# EasyEDA Pro project F401.eprj

# Schematic Schematic1
Board Name: Board1; Create Date: 2025-04-14; Page Name: P1; Project Name: F401; Schematic Name: Schematic1; Update Date: 2025-04-16; Company: 嘉立创EDA; Page Size: A4; Version: V1.0
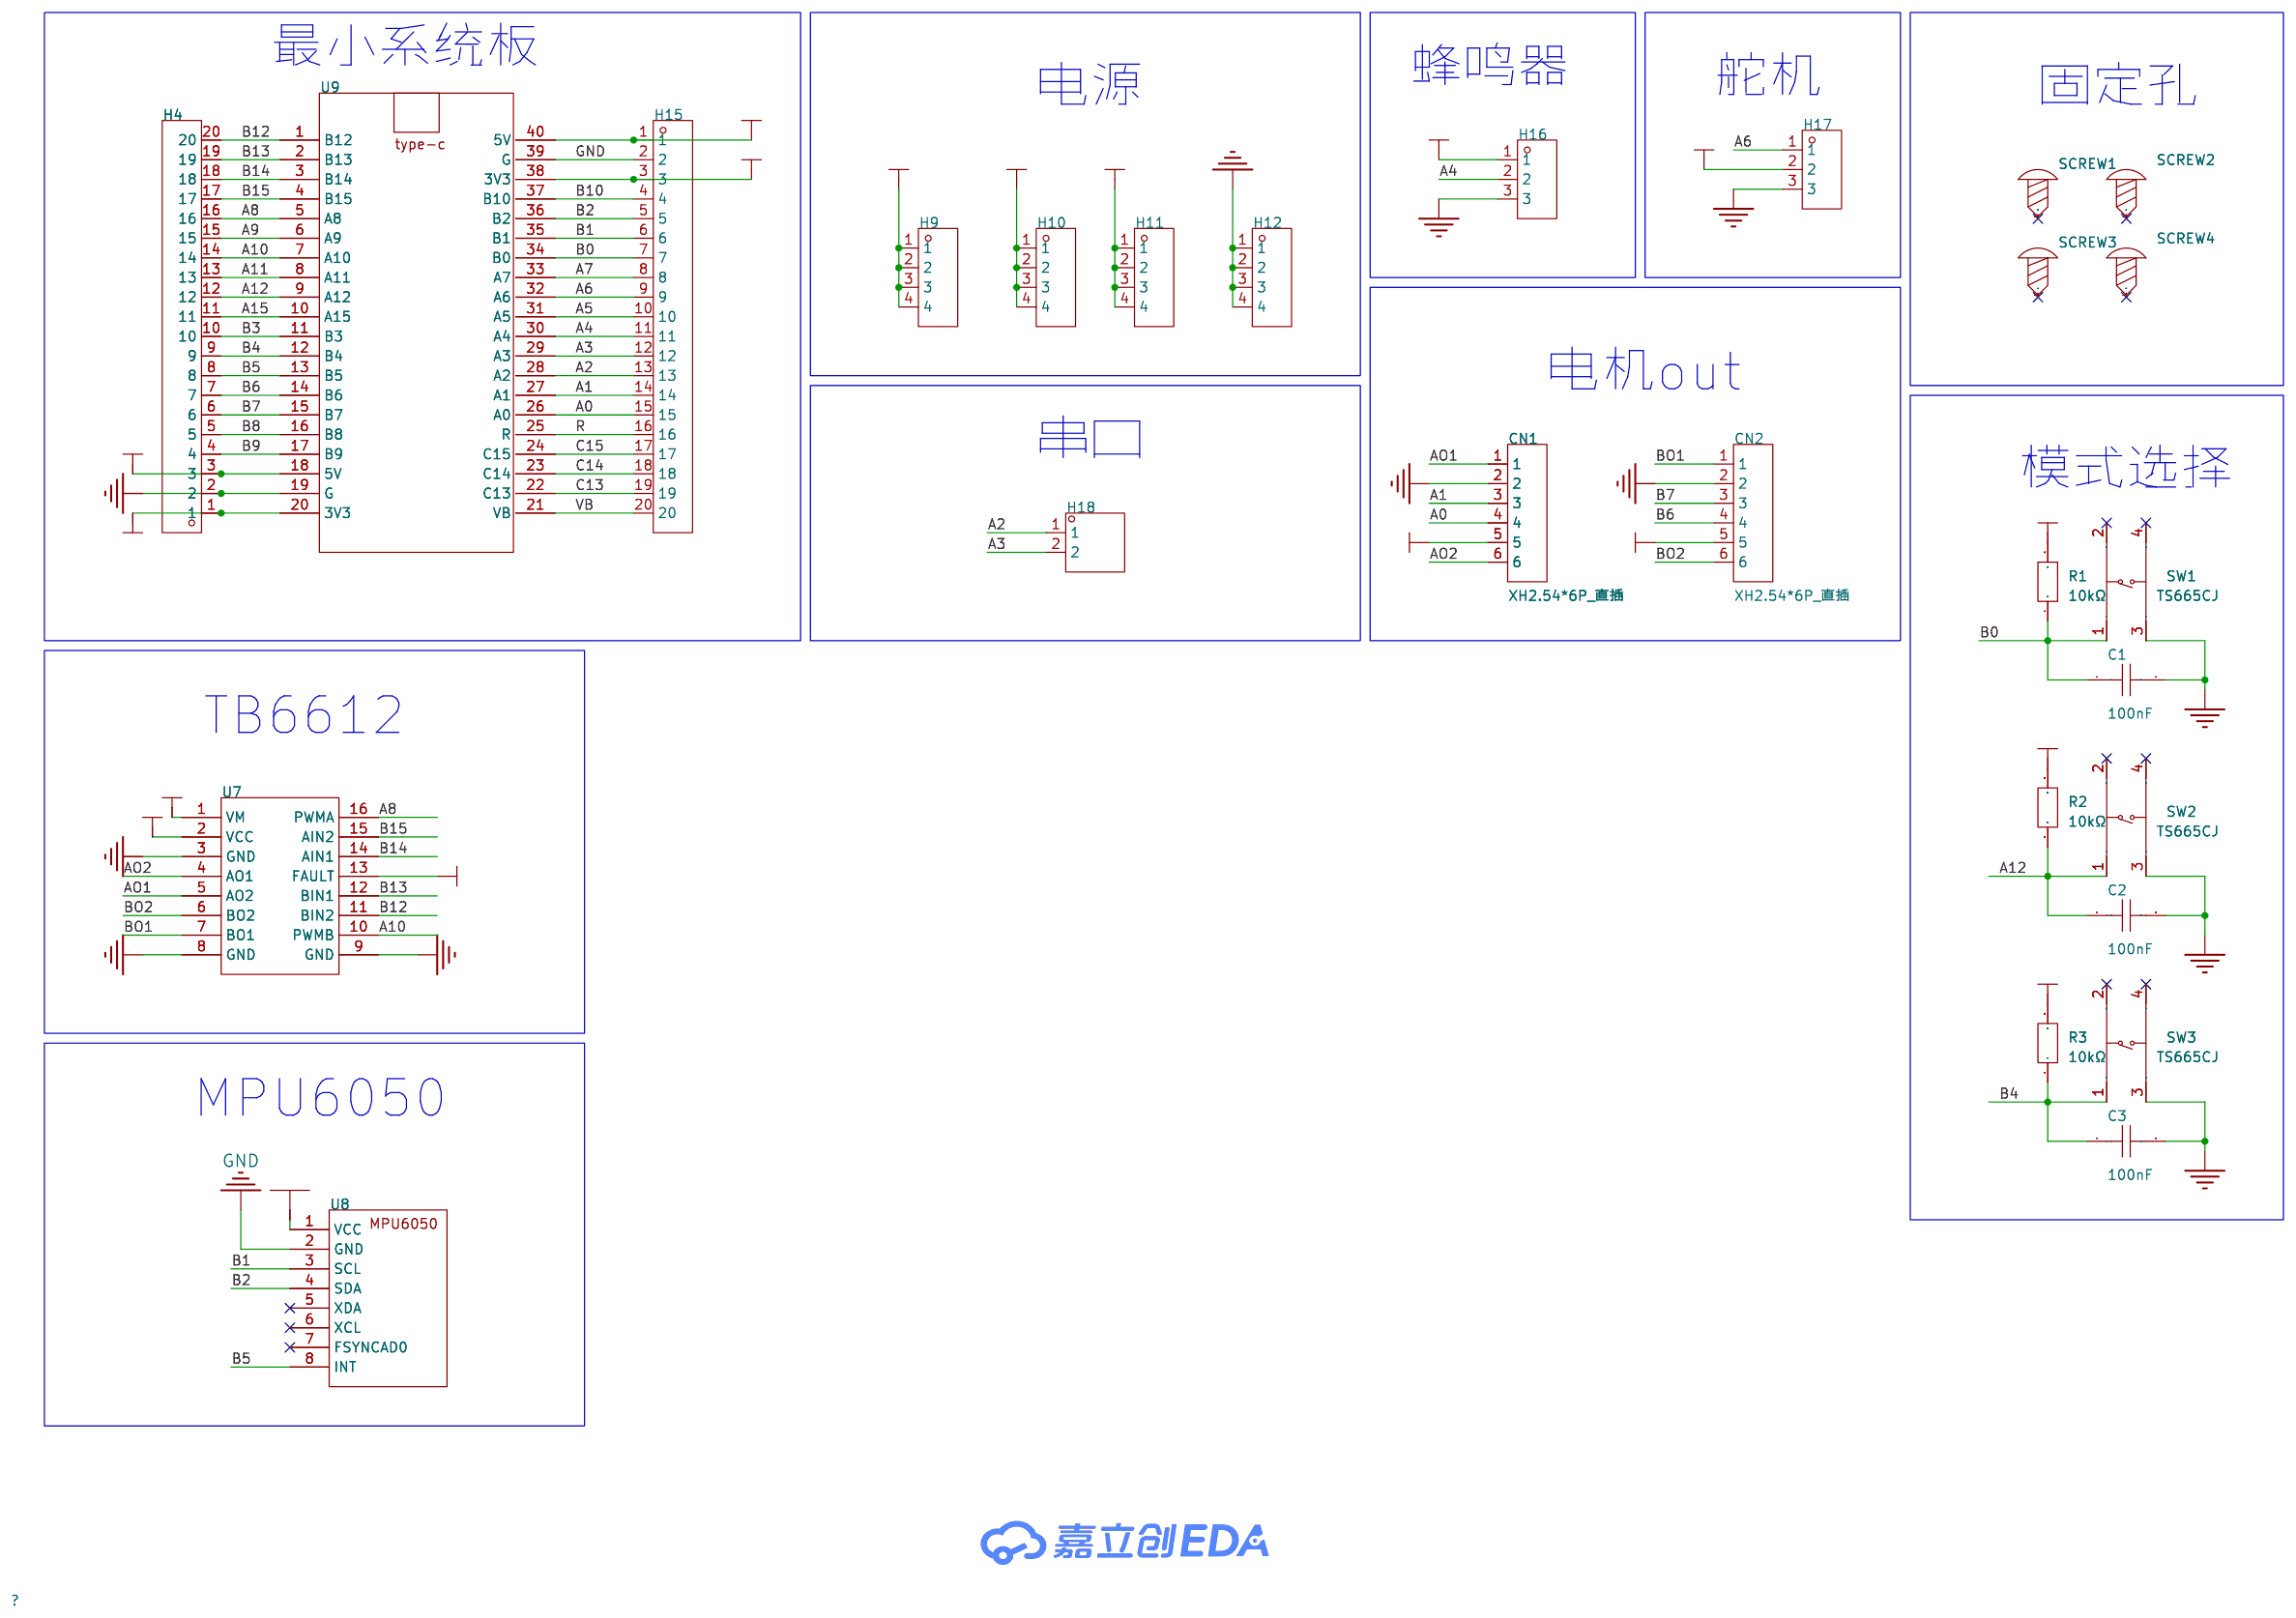
[diagram p0: schematic sheet]

## Parts
C1  100nF  [CAP-TH_L5.0-W2.5-P5.00-D1.0]
C2  100nF  [CAP-TH_L5.0-W2.5-P5.00-D1.0]
C3  100nF  [CAP-TH_L5.0-W2.5-P5.00-D1.0]
CN1  XH2.54*6P_直插  [CONN-TH_XH2.54-6P]
CN2  XH2.54*6P_直插  [CONN-TH_XH2.54-6P]
H4  -  [HDR-TH_20P-P2.54-V-M-1]
H9  -  [HDR-TH_4P-P2.54-V-M]
H10  -  [HDR-TH_4P-P2.54-V-M]
H11  -  [HDR-TH_4P-P2.54-V-M]
H12  -  [HDR-TH_4P-P2.54-V-M]
H15  -  [HDR-TH_20P-P2.54-V-M-1]
H16  -  [HDR-TH_3P-P2.54-V-F]
H17  -  [HDR-TH_3P-P2.54-V-M]
H18  -  [HDR-TH_2P-P2.54-V-M-1]
R1  10kΩ  [RES-TH_BD2.7-L6.2-P10.20-D0.4]
R2  10kΩ  [RES-TH_BD2.7-L6.2-P10.20-D0.4]
R3  10kΩ  [RES-TH_BD2.7-L6.2-P10.20-D0.4]
SCREW1  -  [M3螺丝]
SCREW2  -  [M3螺丝]
SCREW3  -  [M3螺丝]
SCREW4  -  [M3螺丝]
SW1  TS665CJ  [SW-TH_4P-L6.0-W6.0-P4.50-LS6.5]
SW2  TS665CJ  [SW-TH_4P-L6.0-W6.0-P4.50-LS6.5]
SW3  TS665CJ  [SW-TH_4P-L6.0-W6.0-P4.50-LS6.5]
U7  -  [TB6612FNG]
U8  -  [MPU6050]
U9  -  [F401CCU6]

## Library data of the parts
C1-C3 = CC1H104MC1FD3F6C10MF: LCSC Part Name: 100nF ±20% 50V; Supplier Part: C254085; Manufacturer: Dersonic(德尔创); Supplier Footprint: 插件,P=5.08mm; JLCPCB Part Class: 扩展库; Datasheet: https://atta.szlcsc.com/upload/public/pdf/source/20200826/C254085_159DD65BF32BF11C9168D341BCE23E6F.pdf; Supplier: LCSC; Tolerance: ±20%; Voltage Rating: 50V; Pin Spacing: 5.08mm; Temperature Coefficient: Y5V; Diameter: 6mm; Body Thickness: 2.2mm
CN1 CN2 = XH2.54*6P_直插: Supplier Part: C9900008614; Supplier Footprint: XH2.54_6P; JLCPCB Part Class: 扩展库; Supplier: LCSC
H4 H15 = HDR-M_2.54_1x20P: 间距:2.54mm;总PIN位数:20;排数:1;插针结构:-;行距:-;安装类型:直插;圆针/方针:-;额定电流:-;额定电压:-;配合针长度:-;塑高:-;触头材质:黄铜;触头镀层:-;颜色:黑色;; Supplier Part: C50981; Supplier Footprint: 插件
H9-H12 = HDR-M_2.54_1x4P: Supplier Part: C492403; Supplier Footprint: 插件
H16 = HDR-F_2.54_1x3P: Supplier Part: C541850; Supplier Footprint: 插件
H17 = HDR-M_2.54_1x3P: Supplier Part: C2937625; Supplier Footprint: 插件
H18 = HDR-M_2.54_1x2P: Supplier Part: C124375; Supplier Footprint: 插件
R1-R3 = MF1/4W-1K±1%-ST52: LCSC Part Name: 金属膜电阻 1kΩ ±1% 250mW; Supplier Part: C2903245; Manufacturer: VO(翔胜); Supplier Footprint: 插件,D2.7xL6.2mm; JLCPCB Part Class: 扩展库; Datasheet: https://atta.szlcsc.com/upload/public/pdf/source/20200609/C601728_5AA4C0C8E12E11069DA2C3356F29D1F2.pdf; Supplier: LCSC; Type: 金属膜电阻; Tolerance: ±1%; Overload Voltage (Max): 250V; Power(Watts): 250mW; Temperature Coefficient: ±100ppm/℃; Operating Temperature Range: -55℃~+155℃
SCREW1-SCREW4 = M3螺丝: Supplier Footprint: 插件
SW1-SW3 = TS665CJ: LCSC Part Name: 6*6*5mm 直插 轻触开关; Supplier Part: C393938; Manufacturer: SHOU HAN(首韩); Supplier Footprint: 插件; JLCPCB Part Class: 扩展库; Datasheet: https://atta.szlcsc.com/upload/public/pdf/source/20190521/C393938_BDABEAC600B4C55E200A80AA129B70BC.pdf; Supplier: LCSC; Circuit: 单刀单掷; Actuator Style: 圆形按钮; Mounting Style: 直插; Switch Length: 6mm; Switch Width: 6mm; Switch Height: 5mm; Contact Current: 50mA; Voltage Rating (DC): 12V
U7 = TB6612FNG
U8 = MPU6050
U9 = F401CCU6

## Nets
3V3: H4.1 H11.1 H11.2 H11.3 H11.4 H15.3 H16.1 R1.2 R2.2 R3.2 U9.20(3V3) U9.38(3V3)
5V: CN1.5 CN2.5 H4.3 H10.1 H10.2 H10.3 H10.4 H15.1 H17.2 U7.2(VCC) U7.13(FAULT) U8.1(VCC) U9.18(5V) U9.40(5V)
12V: H9.1 H9.2 H9.3 H9.4 U7.1(VM)
GND: C1.2 C2.2 C3.2 CN1.2 CN2.2 H4.2 H12.1 H12.2 H12.3 H12.4 H15.2 H16.3 H17.3 SW1.3(C) SW2.3(C) SW3.3(C) U7.3(GND) U7.8(GND) U7.9(GND) U8.2(GND) U9.19(G) U9.39(G)
A0: CN1.4 H15.15 U9.26(A0)
A1: CN1.3 H15.14 U9.27(A1)
A2: H15.13 H18.1 U9.28(A2)
A3: H15.12 H18.2 U9.29(A3)
A4: H15.11 H16.2 U9.30(A4)
A5: H15.10 U9.31(A5)
A6: H15.9 H17.1 U9.32(A6)
A7: H15.8 U9.33(A7)
A8: H4.16 U7.16(PWMA) U9.5(A8)
A9: H4.15 U9.6(A9)
A10: H4.14 U7.10(PWMB) U9.7(A10)
A11: H4.13 U9.8(A11)
A12: C2.1 H4.12 R2.1 SW2.1(A) U9.9(A12)
A15: H4.11 U9.10(A15)
AO1: CN1.1 U7.5(AO2)
AO2: CN1.6 U7.4(AO1)
B0: C1.1 H15.7 R1.1 SW1.1(A) U9.34(B0)
B1: H15.6 U8.3(SCL) U9.35(B1)
B2: H15.5 U8.4(SDA) U9.36(B2)
B3: H4.10 U9.11(B3)
B4: C3.1 H4.9 R3.1 SW3.1(A) U9.12(B4)
B5: H4.8 U8.8(INT) U9.13(B5)
B6: CN2.4 H4.7 U9.14(B6)
B7: CN2.3 H4.6 U9.15(B7)
B8: H4.5 U9.16(B8)
B9: H4.4 U9.17(B9)
B10: H15.4 U9.37(B10)
B12: H4.20 U7.11(BIN2) U9.1(B12)
B13: H4.19 U7.12(BIN1) U9.2(B13)
B14: H4.18 U7.14(AIN1) U9.3(B14)
B15: H4.17 U7.15(AIN2) U9.4(B15)
BO1: CN2.1 U7.7(BO1)
BO2: CN2.6 U7.6(BO2)
C13: H15.19 U9.22(C13)
C14: H15.18 U9.23(C14)
C15: H15.17 U9.24(C15)
R: H15.16 U9.25(R)
VB: H15.20 U9.21(VB)

Not connected (* = marked no-connect by the designer): SCREW1 1*; SCREW2 1*; SCREW3 1*; SCREW4 1*; SW1 2(B)* 4(D)*; SW2 2(B)* 4(D)*; SW3 2(B)* 4(D)*; U8 5(XDA)* 6(XCL)* 7(FSYNCAD0)*

## Notes on the sheet
- 最小系统板
- 蜂鸣器
- 电源
- 舵机
- 固定孔
- 电机out
- 串口
- 模式选择
- TB6612
- MPU6050

# Board PCB1
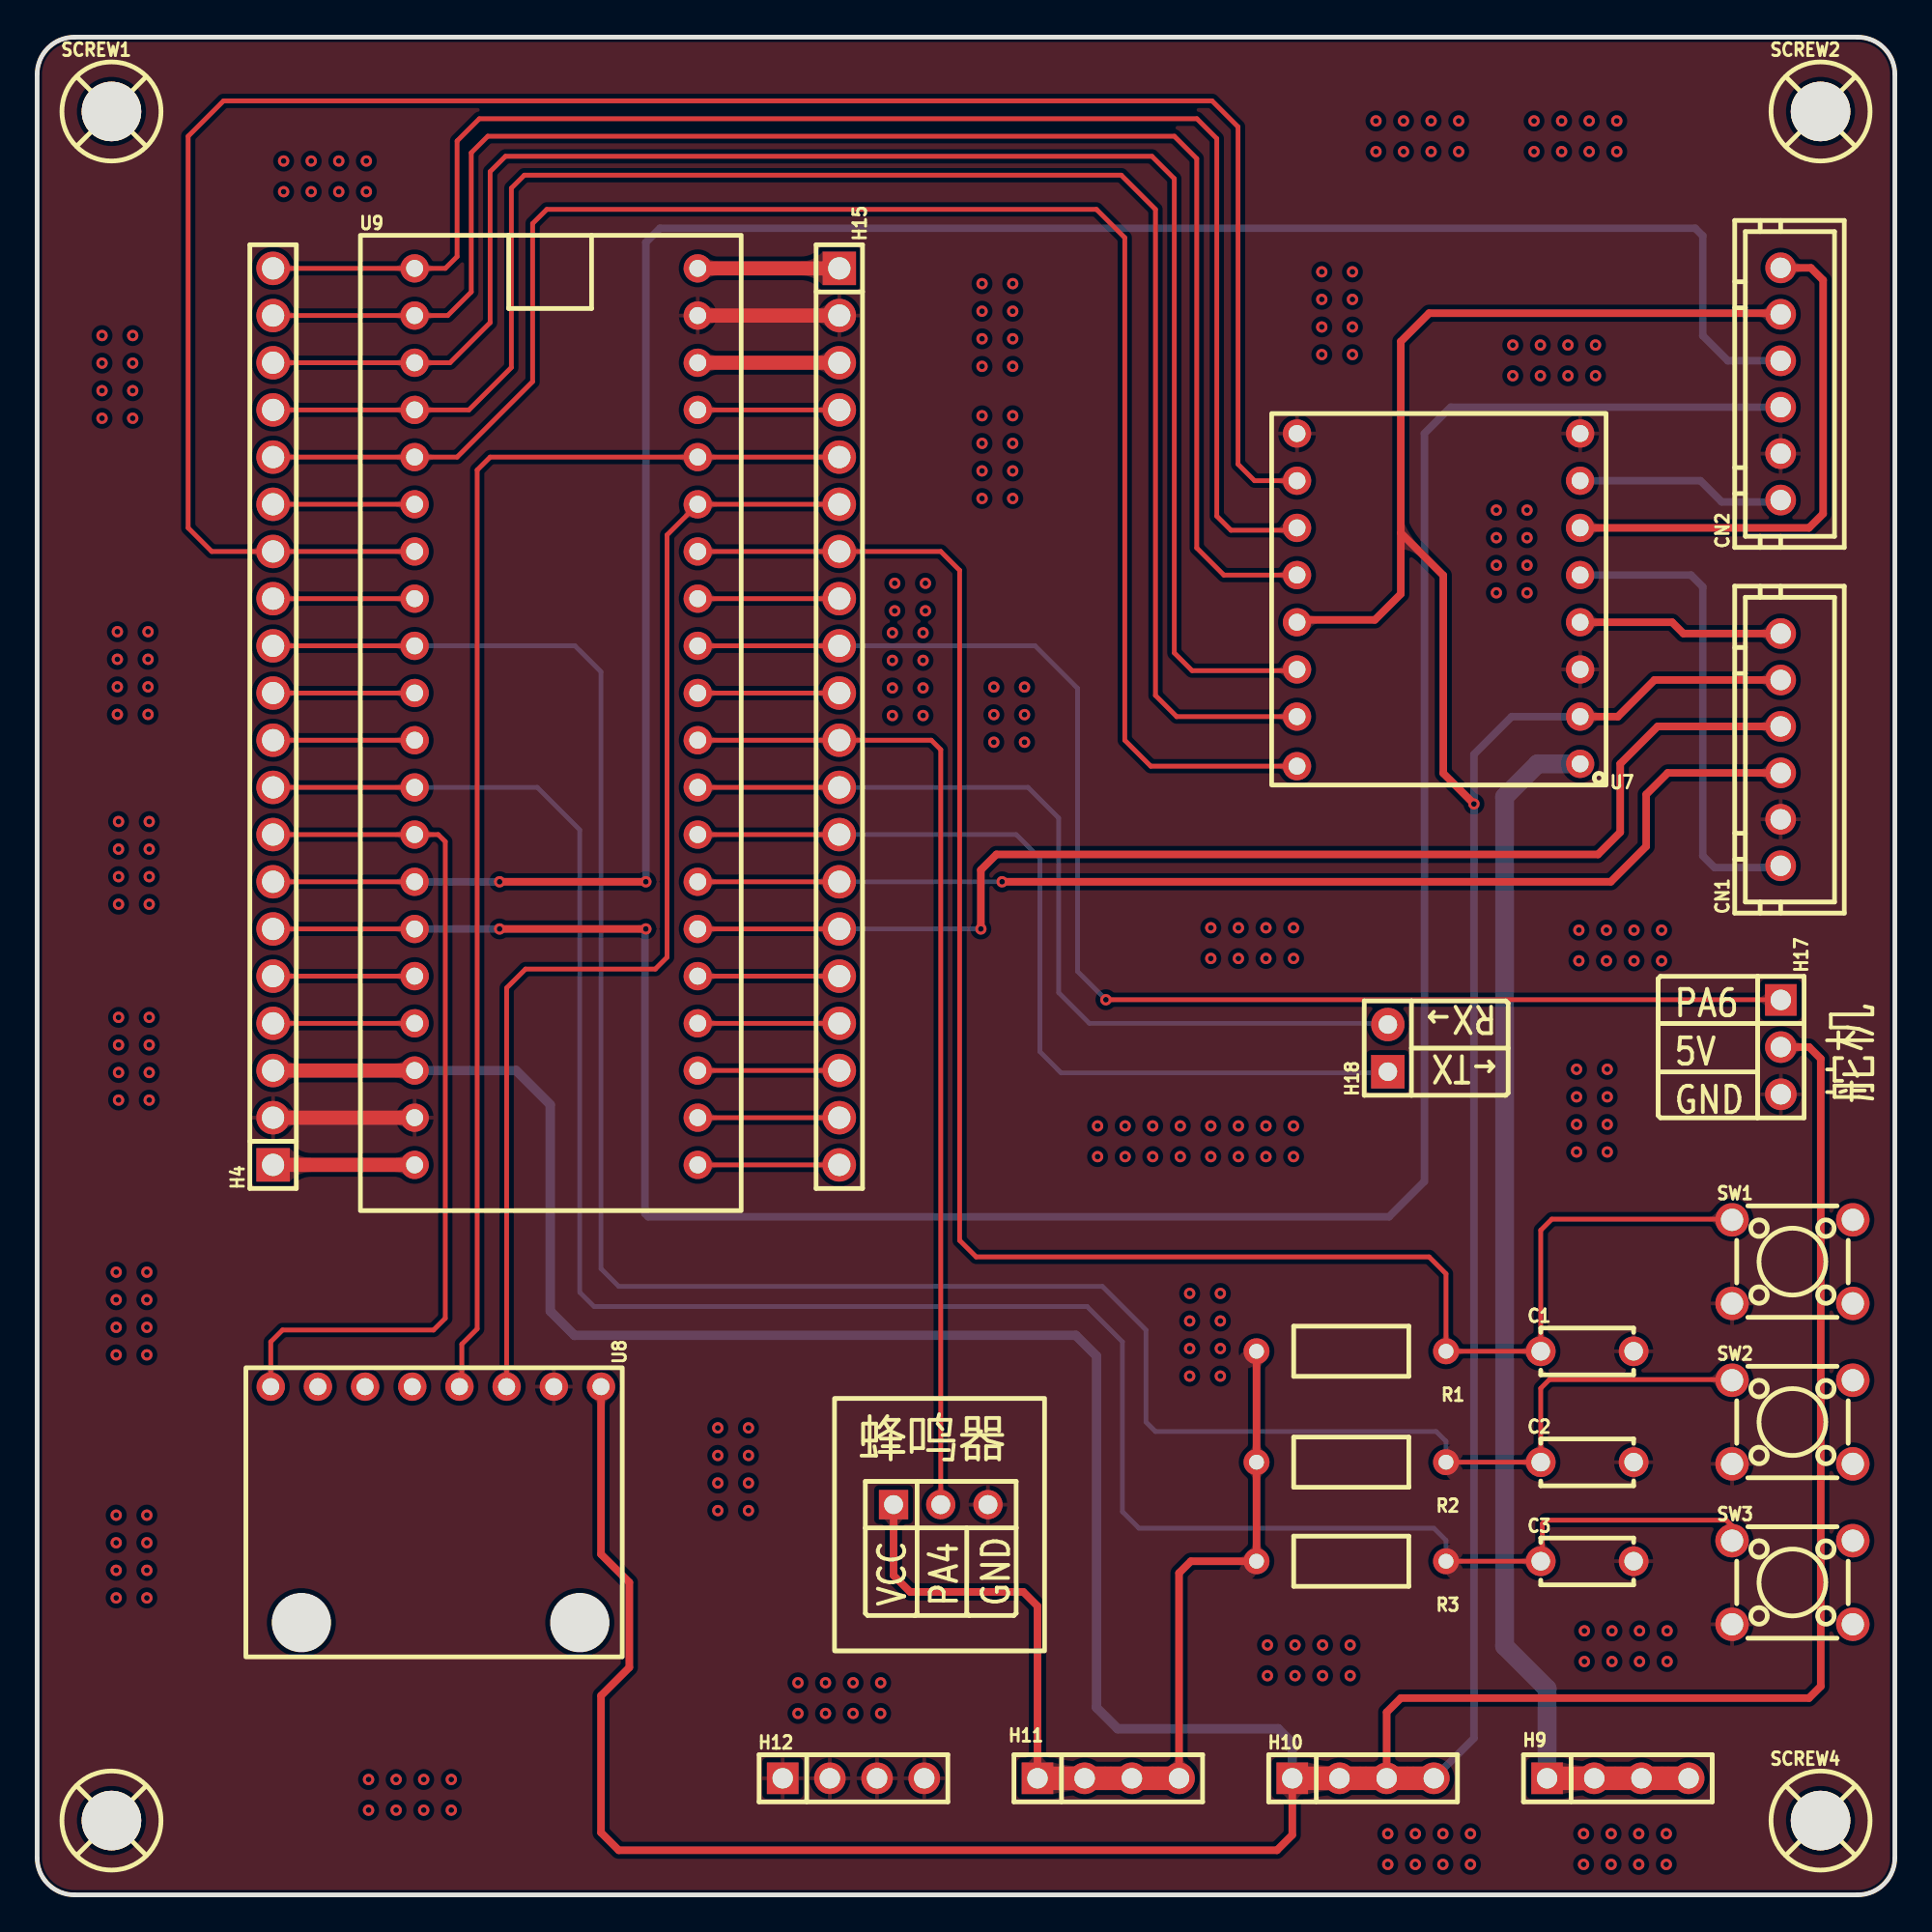
[diagram p1: board, top side]
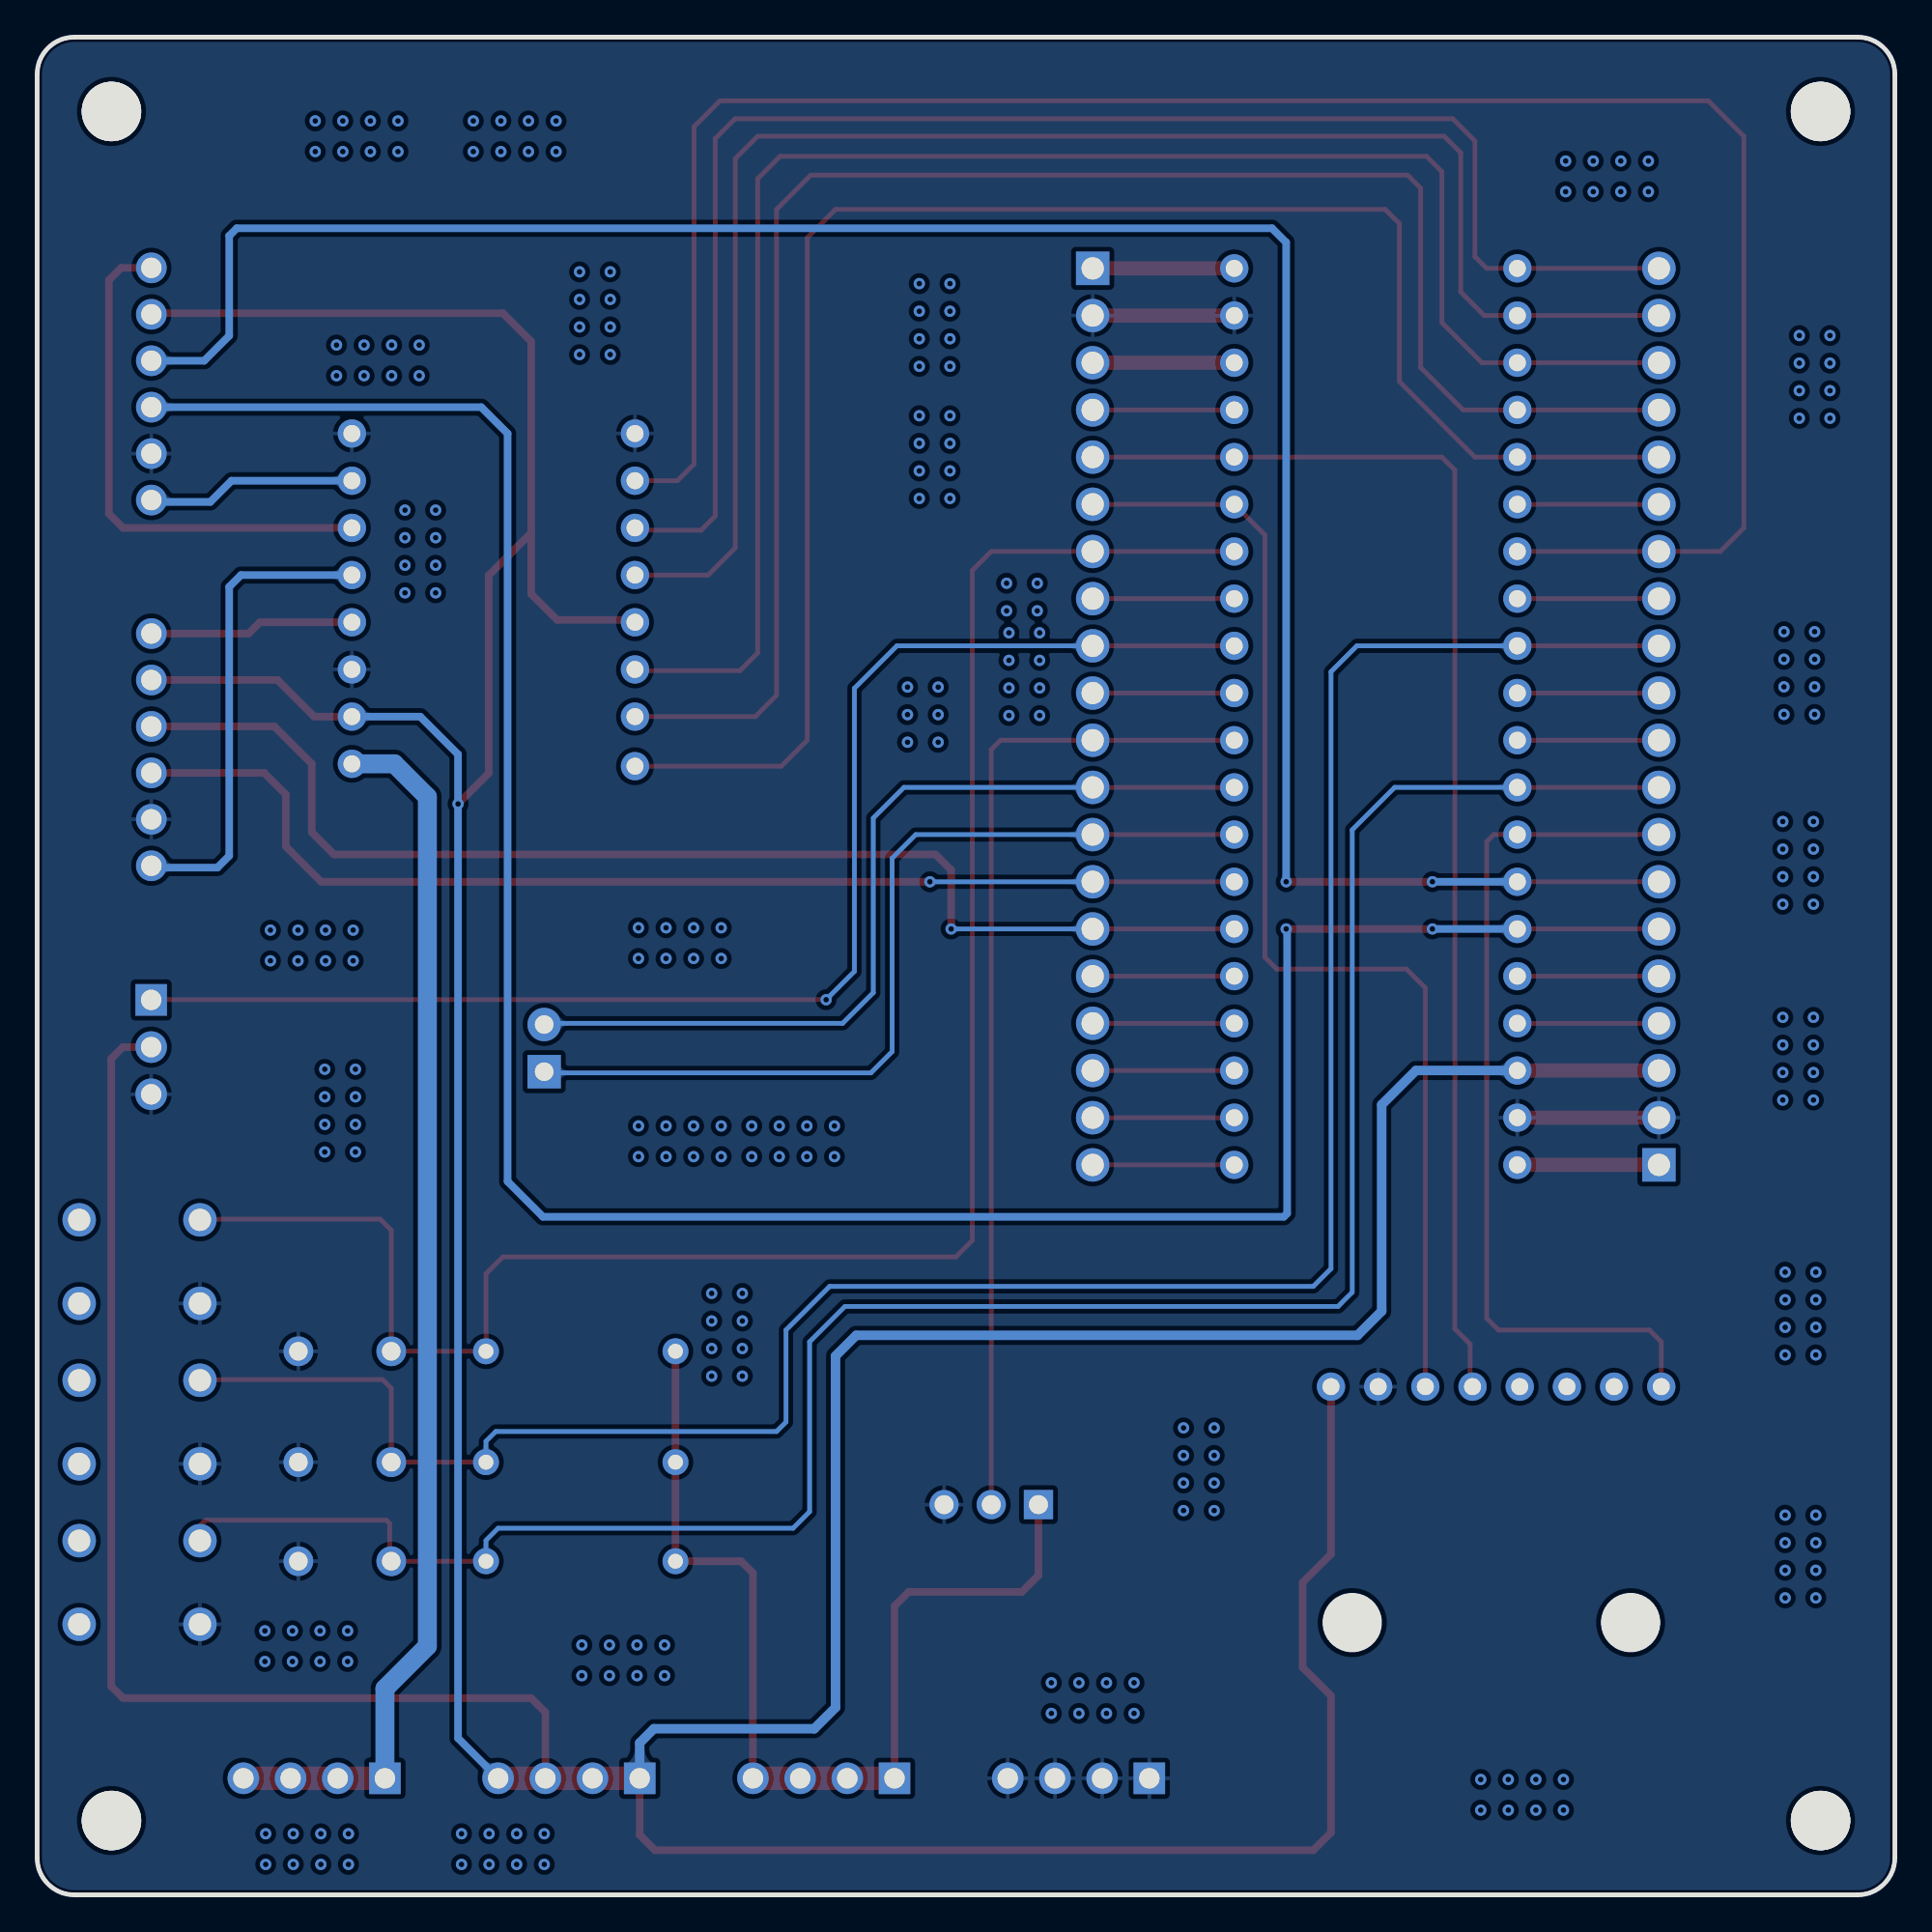
[diagram p2: board, bottom side, seen from below]

Outline 100 x 100 mm; copper layers: Top Layer, Bottom Layer. Coordinates in mm from the lower left corner of the outline.
Outline path: 0,98 0,2 arc(0.59,0.59) 2,0 98,0 arc(99.41,0.59) 100,2 100,98 arc(99.41,99.41) 98,100 2,100 arc(0.59,99.41) 0,98
Stack: Top Layer 0.035mm / Dielectric1 1.51mm FR4 er 4.5 / Bottom Layer 0.035mm

## Design rules (mm)
template: JLCPCB Capability(Two Layers Board)
spacing copperThickness1oz (default): track to track 0.102, other pairs 0.152 to 0.3
spacing copperThickness2oz: track to track 0.203, other pairs 0.152 to 0.3
track width copperThickness1oz (default): min 0.127, default 0.254, max 2.54
track width copperThickness2oz: min 0.203, default 0.254, max 2.54
differential pair differentialPair (default): width min 0.127, default 0.254, max 2.54; gap min 0.152, default 0.152
via viaSize (default): diameter min 0.5, default 0.61, max 10; hole min 0.3, default 0.305, max 6.3

## Placement (name value [footprint] x y rotation side)
C1  100nF  [CAP-TH_L5.0-W2.5-P5.00-D1.0]  83.44 29.26 0 top
C2  100nF  [CAP-TH_L5.0-W2.5-P5.00-D1.0]  83.44 23.29 0 top
C3  100nF  [CAP-TH_L5.0-W2.5-P5.00-D1.0]  83.44 17.96 0 top
CN1  XH2.54*6P_直插  [CONN-TH_XH2.54-6P]  93.85 61.65 90 top
CN2  XH2.54*6P_直插  [CONN-TH_XH2.54-6P]  93.85 81.33 90 top
H4  -  [HDR-TH_20P-P2.54-V-M-1]  12.7 63.42 90 top
H9  -  [HDR-TH_4P-P2.54-V-M]  85.09 6.27 0 top
H10  -  [HDR-TH_4P-P2.54-V-M]  71.37 6.27 0 top
H11  -  [HDR-TH_4P-P2.54-V-M]  57.66 6.27 0 top
H12  -  [HDR-TH_4P-P2.54-V-M]  43.94 6.27 0 top
H15  -  [HDR-TH_20P-P2.54-V-M-1]  43.18 63.42 270 top
H16  -  [HDR-TH_3P-P2.54-V-F]  48.64 21.01 0 top
H17  -  [HDR-TH_3P-P2.54-V-M]  93.86 45.63 270 top
H18  -  [HDR-TH_2P-P2.54-V-M-1]  72.71 45.58 90 top
R1  10kΩ  [RES-TH_BD2.7-L6.2-P10.20-D0.4]  70.74 29.26 180 top
R2  10kΩ  [RES-TH_BD2.7-L6.2-P10.20-D0.4]  70.74 23.29 180 top
R3  10kΩ  [RES-TH_BD2.7-L6.2-P10.20-D0.4]  70.74 17.96 180 top
SCREW1  -  [M3螺丝]  4 96 0 top
SCREW2  -  [M3螺丝]  96 96 0 top
SCREW3  -  [M3螺丝]  4 4 0 top
SCREW4  -  [M3螺丝]  96 4 0 top
SW1  TS665CJ  [SW-TH_4P-L6.0-W6.0-P4.50-LS6.5]  94.49 34.09 0 top
SW2  TS665CJ  [SW-TH_4P-L6.0-W6.0-P4.50-LS6.5]  94.49 25.45 0 top
SW3  TS665CJ  [SW-TH_4P-L6.0-W6.0-P4.50-LS6.5]  94.49 16.81 0 top
U7  -  [TB6612FNG]  83.06 60.88 180 top
U8  -  [MPU6050]  30.35 27.36 270 top
U9  -  [F401CCU6]  20.32 87.55 0 top

## Footprints (pads in the part's own frame, mm; a bottom-side part is the same pattern mirrored in y, then rotated)
CAP-TH_L5.0-W2.5-P5.00-D1.0
  round 1.6 hole 1: 1(-2.5,0) 2(2.5,0)
CONN-TH_XH2.54-6P
  round 1.65 hole 1.1: 1(-6.25,0) 2(-3.75,0) 3(-1.25,0) 4(1.25,0) 5(3.75,0) 6(6.25,0)
F401CCU6
  round 1.524 hole 0.914: 1(0,0) 2(0,-2.54) 3(0,-5.08) 4(0,-7.62) 5(0,-10.16) 6(0,-12.7) 7(0,-15.24) 8(0,-17.78) 9(0,-20.32) 10(0,-22.86) 11(0,-25.4) 12(0,-27.94) 13(0,-30.48) 14(0,-33.02) 15(0,-35.56) 16(0,-38.1) 17(0,-40.64) 18(0,-43.18) 19(0,-45.72) 20(0,-48.26) 21(15.24,-48.26) 22(15.24,-45.72) 23(15.24,-43.18) 24(15.24,-40.64) 25(15.24,-38.1) 26(15.24,-35.56) 27(15.24,-33.02) 28(15.24,-30.48) 29(15.24,-27.94) 30(15.24,-25.4) 31(15.24,-22.86) 32(15.24,-20.32) 33(15.24,-17.78) 34(15.24,-15.24) 35(15.24,-12.7) 36(15.24,-10.16) 37(15.24,-7.62) 38(15.24,-5.08) 39(15.24,-2.54) 40(15.24,0)
HDR-TH_2P-P2.54-V-M-1
  rect 1.8x1.8 hole 1: 1(-1.27,0)
  round 1.8 hole 1: 2(1.27,0)
HDR-TH_3P-P2.54-V-F
  rect 1.575x1.575 hole 1.02: 1(-2.54,0)
  round 1.575 hole 1.02: 2(0,0) 3(2.54,0)
HDR-TH_3P-P2.54-V-M
  rect 1.7x1.7 hole 1.1: 1(-2.54,0)
  round 1.7 hole 1.1: 2(0,0) 3(2.54,0)
HDR-TH_4P-P2.54-V-M
  rect 1.7x1.7 hole 1.1: 1(-3.81,0)
  round 1.7 hole 1.1: 2(-1.27,0) 3(1.27,0) 4(3.81,0)
HDR-TH_20P-P2.54-V-M-1
  rect 1.8x1.8 hole 1.2: 1(-24.13,0)
  round 1.8 hole 1.2: 2(-21.59,0) 3(-19.05,0) 4(-16.51,0) 5(-13.97,0) 6(-11.43,0) 7(-8.89,0) 8(-6.35,0) 9(-3.81,0) 10(-1.27,0) 11(1.27,0) 12(3.81,0) 13(6.35,0) 14(8.89,0) 15(11.43,0) 16(13.97,0) 17(16.51,0) 18(19.05,0) 19(21.59,0) 20(24.13,0)
M3螺丝
  round 3.2 hole 3.2: 1(0,0)
MPU6050
  round 1.524 hole 0.914: 1(0,0) 2(0,-2.54) 3(0,-5.08) 4(0,-7.62) 5(0,-10.16) 6(0,-12.7) 7(0,-15.24) 8(0,-17.78)
RES-TH_BD2.7-L6.2-P10.20-D0.4
  round 1.4 hole 0.8: 1(-5.1,0) 2(5.1,0)
SW-TH_4P-L6.0-W6.0-P4.50-LS6.5
  round 1.8 hole 1.2: 1(-3.25,2.25) 2(3.25,2.25) 3(-3.25,-2.25) 4(3.25,-2.25)
TB6612FNG
  round 1.524 hole 0.914: 1(0,0) 2(0,-2.54) 3(0,-5.08) 4(0,-7.62) 5(0,-10.16) 6(0,-12.7) 7(0,-15.24) 8(0,-17.78) 9(15.24,-17.78) 10(15.24,-15.24) 11(15.24,-12.7) 12(15.24,-10.16) 13(15.24,-7.62) 14(15.24,-5.08) 15(15.24,-2.54) 16(15.24,0.127)

## Nets
As in the schematic.

Pads without a net: SCREW1 1; SCREW2 1; SCREW3 1; SCREW4 1; SW1 2 4; SW2 2 4; SW3 2 4; U8 5 6 7

## Via types
v1: diameter 0.61, hole 0.305, Top Layer to Bottom Layer, 242 vias

## Routing (per net, layer and track width the routed paths; a pad name or vN(x,y) marks a point on that pad's centre or on a via; arc(x,y) is an arc through that point)
3V3: length 71.2
  Top Layer w0.406: H16.1 46.1,17.2 46.99,16.31 53.09,16.31 53.85,15.54 H11.1 ; R1.2 R2.2 R3.2 62.1,17.96 61.47,17.32 H11.4
  Top Layer w0.762: U9.38 H15.3 ; H4.1 U9.20
  Top Layer w1.27: H11.1 H11.2 H11.3 H11.4
5V: length 365.9
  Top Layer w0.406: H10.3 72.64,9.83 73.41,10.59 95.38,10.59 96.01,11.23 96.01,45.01 95.39,45.63 H17.2 ; 73.41,73.31 73.41,83.62 74.93,85.14 93.79,85.14 CN2.5 ; 73.41,73.31 75.69,71.03 75.69,60.38 v1(77.34,58.72) ; 73.41,73.31 73.41,70.03 72.01,68.63 67.94,68.63 U7.13 ; U7.2 85.09,63.42 87.06,65.4 CN1.5 ; U8.1 30.35,18.34 31.88,16.81 31.88,12.24 30.35,10.72 30.35,3.35 31.31,2.4 66.74,2.4 67.56,3.23 H10.1
  Top Layer w0.762: U9.40 H15.1 ; H4.3 U9.18
  Top Layer w1.27: H10.1 H10.2 H10.3 H10.4
  Bottom Layer w0.406: U7.2 79.38,63.42 77.34,61.39 v1(77.34,58.72) 77.34,8.43 H10.4
  Bottom Layer w0.508: U9.18 25.78,44.37 27.62,42.53 27.62,31.42 28.92,30.12 55.91,30.12 57.02,29.01 57.02,10.08 58.17,8.94 66.8,8.94 67.56,8.18 H10.1
12V: length 66.2
  Top Layer w1.27: H9.1 H9.2 H9.3 H9.4
  Bottom Layer w1.016: H9.1 81.28,11.1 78.99,13.39 78.99,59.11 80.77,60.88 U7.1
GND: length 15.2
  Top Layer w0.762: H4.2 U9.19 ; U9.39 H15.2
(no net):
  vias: v1(3.49,83.94) v1(3.49,82.45) v1(3.49,80.97) v1(3.49,79.49) v1(4.32,68) v1(4.32,66.51) v1(4.32,65.03) v1(4.32,63.54) v1(4.25,33.52) v1(4.25,32.03) v1(4.25,30.55) v1(4.25,29.07) v1(4.25,20.44) v1(4.25,18.95) v1(4.25,17.47) v1(4.25,15.99) v1(4.38,57.78) v1(4.38,56.29) v1(4.38,54.81) v1(4.38,53.32) v1(4.38,47.24) v1(4.38,45.75) v1(4.38,44.27) v1(4.38,42.78) v1(5.14,83.94) v1(5.14,82.45) v1(5.14,80.97) v1(5.14,79.49) v1(5.91,33.52) v1(5.91,32.03) v1(5.91,30.55) v1(5.91,29.07) v1(5.91,20.44) v1(5.91,18.95) v1(5.91,17.47) v1(5.91,15.99) v1(5.97,68) v1(5.97,66.51) v1(5.97,65.03) v1(5.97,63.54) v1(6.03,57.78) v1(6.03,56.29) v1(6.03,54.81) v1(6.03,53.32) v1(6.03,47.24) v1(6.03,45.75) v1(6.03,44.27) v1(6.03,42.78) v1(13.27,93.33) v1(13.27,91.68) v1(14.75,93.33) v1(14.75,91.68) v1(16.24,93.33) v1(16.24,91.68) v1(17.72,93.33) v1(17.72,91.68) v1(17.84,6.21) v1(17.84,4.56) v1(19.32,6.21) v1(19.32,4.56) v1(20.81,6.21) v1(20.81,4.56) v1(22.29,6.21) v1(22.29,4.56) v1(36.64,25.14) v1(36.64,23.65) v1(36.64,22.17) v1(36.64,20.68) v1(38.29,25.14) v1(38.29,23.65) v1(38.29,22.17) v1(38.29,20.68) v1(40.95,11.42) v1(40.95,9.77) v1(42.44,11.42) v1(42.44,9.77) v1(43.92,11.42) v1(43.92,9.77) v1(45.41,11.42) v1(45.41,9.77) v1(46.04,67.94) v1(46.04,66.45) v1(46.04,64.97) v1(46.04,63.48) v1(46.16,70.6) v1(46.16,69.12) v1(47.69,67.94) v1(47.69,66.45) v1(47.69,64.97) v1(47.69,63.48) v1(47.82,70.6) v1(47.82,69.12) v1(50.86,86.73) v1(50.86,85.25) v1(50.86,83.76) v1(50.86,82.28) v1(50.86,79.62) v1(50.86,78.14) v1(50.86,76.65) v1(50.86,75.17) v1(51.5,65.02) v1(51.5,63.53) v1(51.5,62.05) v1(52.51,86.73) v1(52.51,85.25) v1(52.51,83.76) v1(52.51,82.28) v1(52.51,79.62) v1(52.51,78.14) v1(52.51,76.65) v1(52.51,75.17) v1(53.15,65.02) v1(53.15,63.53) v1(53.15,62.05) v1(57.08,41.39) v1(57.08,39.74) v1(58.57,41.39) v1(58.57,39.74) v1(60.05,41.39) v1(60.05,39.74) v1(61.54,41.39) v1(61.54,39.74) v1(62.04,32.38) v1(62.04,30.89) v1(62.04,29.41) v1(62.04,27.92) v1(63.18,52.06) v1(63.18,50.41) v1(63.18,41.39) v1(63.18,39.74) v1(63.69,32.38) v1(63.69,30.89) v1(63.69,29.41) v1(63.69,27.92) v1(64.66,52.06) v1(64.66,50.41) v1(64.66,41.39) v1(64.66,39.74) v1(66.15,52.06) v1(66.15,50.41) v1(66.15,41.39) v1(66.15,39.74) v1(66.23,13.45) v1(66.23,11.8) v1(67.63,52.06) v1(67.63,50.41) v1(67.63,41.39) v1(67.63,39.74) v1(67.71,13.45) v1(67.71,11.8) v1(69.15,87.37) v1(69.15,85.88) v1(69.15,84.4) v1(69.15,82.91) v1(69.19,13.45) v1(69.19,11.8) v1(70.68,13.45) v1(70.68,11.8) v1(70.8,87.37) v1(70.8,85.88) v1(70.8,84.4) v1(70.8,82.91) v1(72.07,95.49) v1(72.07,93.84) v1(72.7,3.29) v1(72.7,1.64) v1(73.55,95.49) v1(73.55,93.84) v1(74.19,3.29) v1(74.19,1.64) v1(75.04,95.49) v1(75.04,93.84) v1(75.67,3.29) v1(75.67,1.64) v1(76.52,95.49) v1(76.52,93.84) v1(77.16,3.29) v1(77.16,1.64) v1(78.55,74.54) v1(78.55,73.06) v1(78.55,71.57) v1(78.55,70.09) v1(79.43,83.43) v1(79.43,81.78) v1(80.2,74.54) v1(80.2,73.06) v1(80.2,71.57) v1(80.2,70.09) v1(80.58,95.49) v1(80.58,93.84) v1(80.92,83.43) v1(80.92,81.78) v1(82.06,95.49) v1(82.06,93.84) v1(82.4,83.43) v1(82.4,81.78) v1(82.87,44.44) v1(82.87,42.96) v1(82.87,41.47) v1(82.87,39.99) v1(82.99,51.93) v1(82.99,50.28) v1(83.24,3.29) v1(83.24,1.64) v1(83.29,14.21) v1(83.29,12.56) v1(83.55,95.49) v1(83.55,93.84) v1(83.89,83.43) v1(83.89,81.78) v1(84.47,51.93) v1(84.47,50.28) v1(84.52,44.44) v1(84.52,42.96) v1(84.52,41.47) v1(84.52,39.99) v1(84.73,3.29) v1(84.73,1.64) v1(84.77,14.21) v1(84.77,12.56) v1(85.03,95.49) v1(85.03,93.84) v1(85.96,51.93) v1(85.96,50.28) v1(86.21,3.29) v1(86.21,1.64) v1(86.26,14.21) v1(86.26,12.56) v1(87.44,51.93) v1(87.44,50.28) v1(87.74,14.21) v1(87.74,12.56) v1(87.7,3.29) v1(87.7,1.64)
A0: length 66.8
  Top Layer w0.254: U9.26 H15.15
  Top Layer w0.406: CN1.4 87.23,62.9 85.22,60.88 85.22,57.2 84.02,56.01 51.64,56.01 50.8,55.17 v1(50.8,51.99)
  Bottom Layer w0.254: v1(50.8,51.99) H15.15
A1: length 62.4
  Top Layer w0.254: U9.27 H15.14
  Top Layer w0.406: CN1.3 87.78,60.4 86.61,59.23 86.61,56.44 84.71,54.53 v1(51.94,54.53)
  Bottom Layer w0.254: v1(51.94,54.53) H15.14
A2: length 48.6
  Top Layer w0.254: U9.28 H15.13
  Bottom Layer w0.254: H15.13 52.71,57.07 53.97,55.8 53.97,45.39 55.12,44.25 72.64,44.25 H18.1
A3: length 47.9
  Top Layer w0.254: U9.29 H15.12
  Bottom Layer w0.254: H18.2 72.64,46.91 56.64,46.91 54.99,48.56 54.99,57.96 53.34,59.61 H15.12
A4: length 53.9
  Top Layer w0.254: U9.30 H15.11 48.13,62.15 48.64,61.65 H16.2
A5: length 7.6
  Top Layer w0.254: U9.31 H15.10
A6: length 75.1
  Top Layer w0.254: U9.32 H15.9 ; H17.1 93.85,48.18 v1(57.53,48.18)
  Bottom Layer w0.254: v1(57.53,48.18) 56.01,49.71 56.01,64.95 53.72,67.23 H15.9
A7: length 7.6
  Top Layer w0.254: U9.33 H15.8
A8: length 93.9
  Top Layer w0.254: H4.16 U9.5 22.61,77.39 26.67,81.46 26.67,89.97 27.43,90.73 57.02,90.73 58.55,89.2 58.55,62.15 59.94,60.76 U7.16
A9: length 7.6
  Top Layer w0.254: H4.15 U9.6
A10: length 113.4
  Top Layer w0.254: U9.7 H4.14 9.4,72.31 8.13,73.58 8.13,94.67 10.03,96.57 63.25,96.57 64.64,95.17 64.64,77.01 65.53,76.12 U7.10
A11: length 7.6
  Top Layer w0.254: H4.13 U9.8
A12: length 122.8
  Top Layer w0.254: H4.12 U9.9 ; 90.73,27.7 90.69,27.74 81.41,27.74 80.94,27.27 C2.1 R2.1
  Bottom Layer w0.254: U9.9 28.96,67.23 30.35,65.84 30.35,33.71 31.31,32.75 57.34,32.75 59.69,30.4 59.69,25.45 60.2,24.94 75.31,24.94 75.84,24.41 R2.1
A15: length 7.6
  Top Layer w0.254: H4.11 U9.10
AO1: length 25.8
  Bottom Layer w0.406: CN1.1 93.75,55.3 90.3,55.3 89.66,55.93 89.66,70.41 89.03,71.04 U7.5
AO2: length 11
  Top Layer w0.406: CN1.6 88.62,67.9 88.01,68.5 U7.4
B0: length 103.4
  Top Layer w0.254: 90.73,36.34 90.69,36.37 81.53,36.37 80.94,35.78 C1.1 R1.1 75.84,33.43 74.93,34.34 50.55,34.34 49.66,35.23 49.66,71.3 48.64,72.31 H15.7 U9.34
B1: length 63.5
  Top Layer w0.254: 25.27,27.36 25.27,48.82 26.29,49.83 33.27,49.83 33.91,50.47 33.91,73.2 U9.35 H15.6
B2: length 69.5
  Top Layer w0.254: H15.5 U9.36 24.38,77.39 23.69,76.7 23.69,30.47 22.86,29.64 22.86,27.48 U8.4
B3: length 7.6
  Top Layer w0.254: H4.10 U9.11
B4: length 119.4
  Top Layer w0.254: SW3.1 91.24,19.86 90.93,20.17 81.21,20.17 81.03,19.99 81.03,18.04 C3.1 R3.1 ; H4.9 U9.12
  Bottom Layer w0.254: U9.12 26.92,59.61 29.21,57.33 29.21,32.44 29.97,31.67 56.51,31.67 58.42,29.77 58.42,20.62 59.31,19.74 75.18,19.74 75.84,19.08 R3.1
B5: length 47.4
  Top Layer w0.254: H4.8 U9.13 21.59,57.07 21.97,56.69 21.97,31.04 21.34,30.4 13.21,30.4 12.57,29.77 12.57,27.36
B6: length 122
  Top Layer w0.254: H4.7 U9.14
  Top Layer w0.406: v1(32.77,54.53) v1(24.89,54.53)
  Bottom Layer w0.406: CN2.4 91.01,82.58 89.66,83.93 89.66,89.31 89.26,89.71 33.53,89.71 32.77,88.95 v1(32.77,54.53) ; v1(24.89,54.53) U9.14
B7: length 138.3
  Top Layer w0.254: H4.6 U9.15
  Top Layer w0.406: v1(32.77,51.99) v1(24.89,51.99)
  Bottom Layer w0.406: v1(24.89,51.99) U9.15 ; CN2.3 76.09,80.08 74.68,78.66 74.68,38.41 72.77,36.5 32.89,36.5 32.71,36.68 32.71,51.94 v1(32.77,51.99)
B8: length 7.6
  Top Layer w0.254: H4.5 U9.16
B9: length 7.6
  Top Layer w0.254: H4.4 U9.17
B10: length 7.6
  Top Layer w0.254: U9.37 H15.4
B12: length 83.2
  Top Layer w0.254: U7.11 67.69,73.46 64.26,73.46 63.5,74.22 63.5,94.54 62.43,95.61 23.8,95.61 22.61,94.41 22.61,88.19 21.97,87.55 U9.1 H4.20
B13: length 85.6
  Top Layer w0.254: U7.12 63.88,71.04 62.42,72.5 62.42,93.46 61.21,94.67 24.26,94.67 23.37,93.78 23.37,86.28 22.1,85.01 U9.2 H4.19
B14: length 90.9
  Top Layer w0.254: H4.18 U9.3 22.22,82.47 24.38,84.63 24.38,92.76 25.21,93.59 60.01,93.59 61.21,92.38 61.21,66.85 62.17,65.9 67.75,65.9 U7.14
B15: length 93.4
  Top Layer w0.254: H4.17 U9.4 23.24,79.93 25.53,82.22 25.53,91.87 26.23,92.57 58.36,92.57 60.2,90.73 60.2,64.57 61.34,63.42 U7.15
BO1: length 11.3
  Bottom Layer w0.406: U7.7 89.53,76.12 90.68,74.98 93.75,74.98 CN2.1
BO2: length 28.5
  Top Layer w0.406: U7.6 95.38,73.58 96.14,74.35 96.14,86.92 95.48,87.58 CN2.6
C13: length 7.6
  Top Layer w0.254: U9.22 H15.19
C14: length 7.6
  Top Layer w0.254: U9.23 H15.18
C15: length 7.6
  Top Layer w0.254: U9.24 H15.17
R: length 7.6
  Top Layer w0.254: U9.25 H15.16
VB: length 7.6
  Top Layer w0.254: U9.21 H15.20

## Copper pours and planes (outline as drawn; the poured copper is in the pictures)
GND on Top Layer: -27.43,130.73 127.38,130.73 127.38,-12.14 -27.43,-12.14
GND on Bottom Layer: -8.51,105.84 110.87,105.84 110.87,-19.25 -8.51,-19.25

Small or netless copper shapes (teardrops, artwork), in the pictures only: 163 on Top Layer, 33 on Bottom Layer

## Text on the board
Top Silkscreen Layer: PA6 | 5V | GND | VCC | PA4 | RX→ | ←TX | 蜂鸣器 | 舵机
